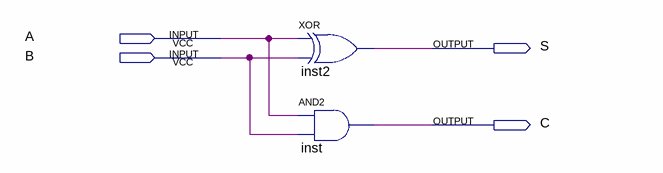
[diagram p0: schematic sheet]
// Quartus schematic ha.bdf as structural Verilog: 2 symbols, 4 pins
module ha (
  input  A,
  input  B,
  output S,
  output C
);

  xor inst2 (S, A, B);
  and inst (C, A, B);
endmodule
